# Altium schematic sheet Acquisition_module.SchDoc
size A4
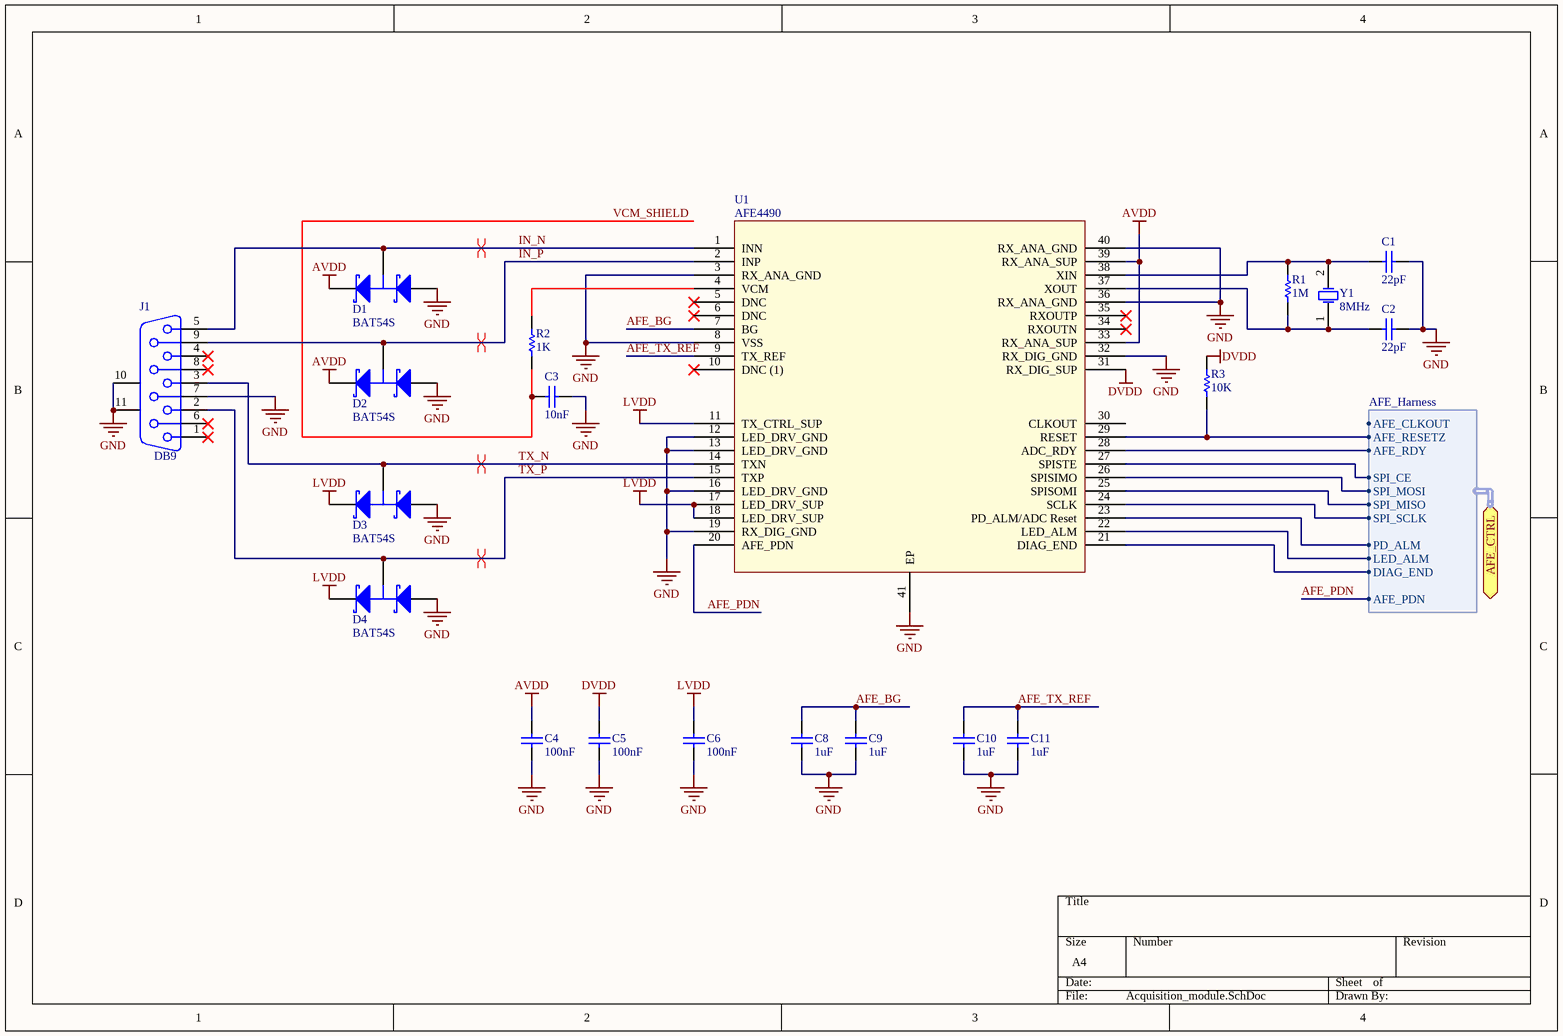
[diagram p0: Acquisition_module.SchDoc]

## Parts
C1  value 22pF  [6-0805_M]  (hidden comment: Cap)
C2  value 22pF  [6-0805_M]  (hidden comment: Cap)
C3  value 10nF  [6-0805_M]  (hidden comment: Cap)
C4  value 100nF  [6-0805_M]  (hidden comment: Cap)
C5  value 100nF  [6-0805_M]  (hidden comment: Cap)
C6  value 100nF  [6-0805_M]  (hidden comment: Cap)
C8  value 1uF  [6-0805_M]  (hidden comment: Cap)
C9  value 1uF  [6-0805_M]  (hidden comment: Cap)
C10  value 1uF  [6-0805_M]  (hidden comment: Cap)
C11  value 1uF  [6-0805_M]  (hidden comment: Cap)
D1  BAT54S  [SOT23_N]
D2  BAT54S  [SOT23_N]
D3  BAT54S  [SOT23_N]
D4  BAT54S  [SOT23_N]
J1  DB9  [DB9]
R1  value 1M  [6-0805_M]  (hidden comment: Res1)
R2  value 1K  [6-0805_M]  (hidden comment: Res1)
R3  value 10K  [6-0805_M]  (hidden comment: Res1)
U1  AFE4490  [AFE4490QFN50P680X680X100_HS-41N]
Y1  8MHz  [Crystal SMD]

## Ports
AFE_CTRL (harness AFE_Harness)

## Harnesses
AFE_Harness: AFE_CLKOUT, AFE_RESETZ, AFE_RDY, SPI_CE, SPI_MOSI, SPI_MISO, SPI_SCLK, PD_ALM, LED_ALM, DIAG_END, AFE_PDN

## Nets
AVDD: C4.2 D1.2(K) D2.2(K) U1.33(RX_ANA_SUP) U1.39(RX_ANA_SUP)
DVDD: C5.2 R3.2 U1.31(RX_DIG_SUP)
GND: C1.1 C2.1 C3.1 C4.1 C5.1 C6.1 C8.1 C9.1 C10.1 C11.1 D1.1(A) D2.1(A) D3.1(A) D4.1(A) J1.7 J1.10(MH1) J1.11(MH2) U1.3(RX_ANA_GND) U1.8(VSS) U1.12(LED_DRV_GND) U1.13(LED_DRV_GND) U1.16(LED_DRV_GND) U1.19(RX_DIG_GND) U1.32(RX_DIG_GND) U1.36(RX_ANA_GND) U1.40(RX_ANA_GND) U1.41(EP)
LVDD: C6.2 D3.2(K) D4.2(K) U1.11(TX_CTRL_SUP) U1.17(LED_DRV_SUP) U1.18(LED_DRV_SUP)
AFE_BG: C8.2 C9.2 U1.7(BG)
AFE_PDN: U1.20(AFE_PDN) ; port AFE_CTRL.AFE_PDN
AFE_TX_REF: C10.2 C11.2 U1.9(TX_REF)
IN_N: D1.3(C) J1.5 U1.1(INN)
IN_P: D2.3(C) J1.9 U1.2(INP)
TX_N: D3.3(C) J1.3 U1.14(TXN)
TX_P: D4.3(C) J1.2 U1.15(TXP)
VCM_SHIELD: C3.2 R2.1
NetC1_2: C1.2 R1.1 U1.38(XIN) Y1.2(OSC2)
NetC2_2: C2.2 R1.2 U1.37(XOUT) Y1.1(OSC1)
NetR2_2: R2.2 U1.4(VCM)
NetR3_1: R3.1 U1.29(RESET) ; port AFE_CTRL.AFE_RESETZ
NetU1_21: U1.21(DIAG_END) ; port AFE_CTRL.DIAG_END
NetU1_22: U1.22(LED_ALM) ; port AFE_CTRL.LED_ALM
NetU1_23: U1.23(PD_ALM/ADC_Reset) ; port AFE_CTRL.PD_ALM
NetU1_24: U1.24(SCLK) ; port AFE_CTRL.SPI_SCLK
NetU1_25: U1.25(SPISOMI) ; port AFE_CTRL.SPI_MISO
NetU1_26: U1.26(SPISIMO) ; port AFE_CTRL.SPI_MOSI
NetU1_27: U1.27(SPISTE) ; port AFE_CTRL.SPI_CE
NetU1_28: U1.28(ADC_RDY) ; port AFE_CTRL.AFE_RDY

Not connected (* = marked no-connect by the designer): J1 1* 4* 6* 8*; U1 5(DNC)* 6(DNC)* 10(DNC_(1))* 30(CLKOUT) 34(RXOUTN)* 35(RXOUTP)*

## Layout directives
differential pair: IN_N, IN_P, TX_N, TX_P

## Library data of the parts
C1-C6 C8-C11 = Cap: Capacitor; Published: 8-Jun-2000; LatestRevisionDate: 17-Jul-2002; LatestRevisionNote: Re-released for DXP Platform.; PackageReference: RAD-0.3; Publisher: Altium Limited; PackageDescription: Radial Cap, Thru-Hole; 2 Leads; 0.3 in Pin Spacing
D1-D4 = BAT54S: Schottky Barrier Double Diode; Published: 17-Sep-2003; LatestRevisionDate: 12-Dec-2006; LatestRevisionNote: IPC-7351 Footprint Added.; DatasheetVersion: 4-Mar-2002; PackageVersion: May-1999; PackageReference: SOT23; Publisher: Altium Limited; PackageDescription: 3-Pin SOT-23 Package 0.95 mm Pitch, 2.3 mm Lead Span; ComponentLink1Description: Manufacturer Link; ComponentLink1URL: http://www.semiconductors.philips.com/; ComponentLink2Description: Datasheet; ComponentLink2URL: http://www.semiconductors.philips.com/acrobat/datasheets/BAT54_SERIES_4.pdf
J1 = D Connector 9: Receptacle Assembly, 9 Position, Right Angle; PackageDocument: O; Positions: 9; Published: 15-Jun-2001; LatestRevisionDate: 17-Jul-2002; LatestRevisionNote: Re-released for DXP Platform.; DatasheetDocument: 1-Sep-1999; PackageReference: 788750; Publisher: Altium Limited; Orientation: Right Angle; Gender: Receptacle
R1-R3 = Res1: Resistor; Published: 8-Jun-2000; LatestRevisionDate: 17-Jul-2002; LatestRevisionNote: Re-released for DXP Platform.; PackageReference: AXIAL-0.3; Publisher: Altium Limited; PackageDescription: Axial Device, Thru-Hole; 2 Leads; 0.3 in Pin Spacing
U1 = AFE4490: Integrated Analog Front-End for Pulse Oximeters
Y1 = XTAL: Crystal Oscillator; Published: 8-Jun-2000; LatestRevisionDate: 17-Jul-2002; LatestRevisionNote: Re-released for DXP Platform.; PackageReference: R38; Publisher: Altium Limited; PackageDescription: Crystal, Thru-Hole; 2 Leads; Body 3.1 x 8.2 mm (Dia.xH)